# EAGLE design shield_ESP (EAGLE 6.5.0)
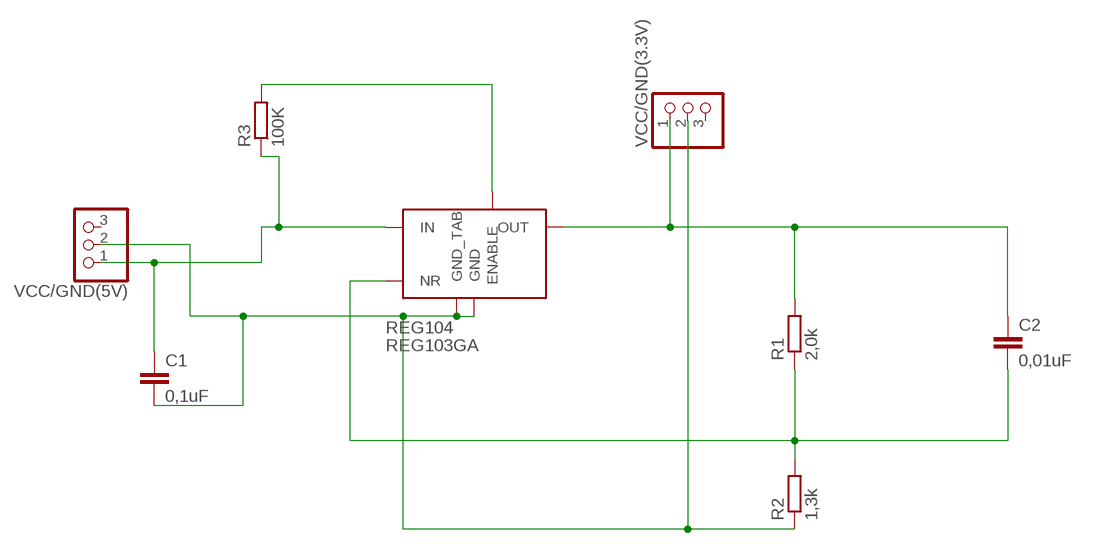
[diagram p0: schematic, sheet 1]

## Parts
C1  0,1uF  C-EU025-025X050  [C025-025X050]
C2  0,01uF  C-EU025-025X050  [C025-025X050]
R1  2,0k  R-EU_0207/7  [0207/7]
R2  1,3k  R-EU_0207/7  [0207/7]
R3  100K  R-EU_0207/7  [0207/7]
REG104  REG103GA  [SOT223-5]
VCC/GND(3.3V)  PINHD-1X3/90  [1X03/90]
VCC/GND(5V)  PINHD-1X3/90  [1X03/90]

## Nets
GOUT: C1.2 R2.1 REG104.3(GND) REG104.TAB(GND_TAB) VCC/GND(3.3V).2 VCC/GND(5V).2
N$1: C1.1 R3.1 REG104.1(IN) VCC/GND(5V).1
N$3: C2.2 R1.1 R2.2 REG104.4(NR)
N$4: R3.2 REG104.5(ENABLE)
VOUT: C2.1 R1.2 REG104.2(OUT) VCC/GND(3.3V).1
Unconnected: VCC/GND(3.3V).3 VCC/GND(5V).3

## Library data of the parts
C1 C2 = rcl:C-EU: CAPACITOR, European symbol
R1-R3 = rcl:R-EU_: RESISTOR, European symbol
REG104 = AlexW-Eagle-Libraries:REG103
VCC/GND(3.3V) VCC/GND(5V) = pinhead:PINHD-1X3: PIN HEADER

## Board
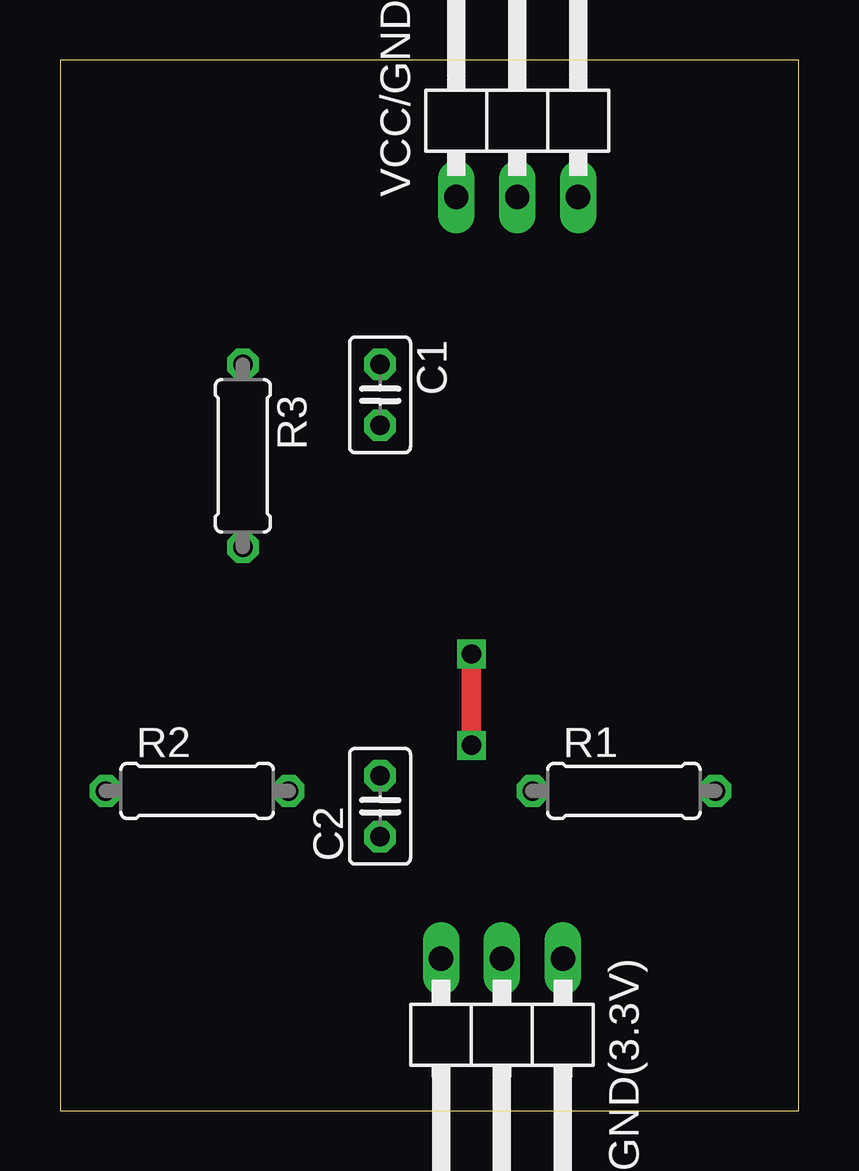
[diagram p1: board, top side]
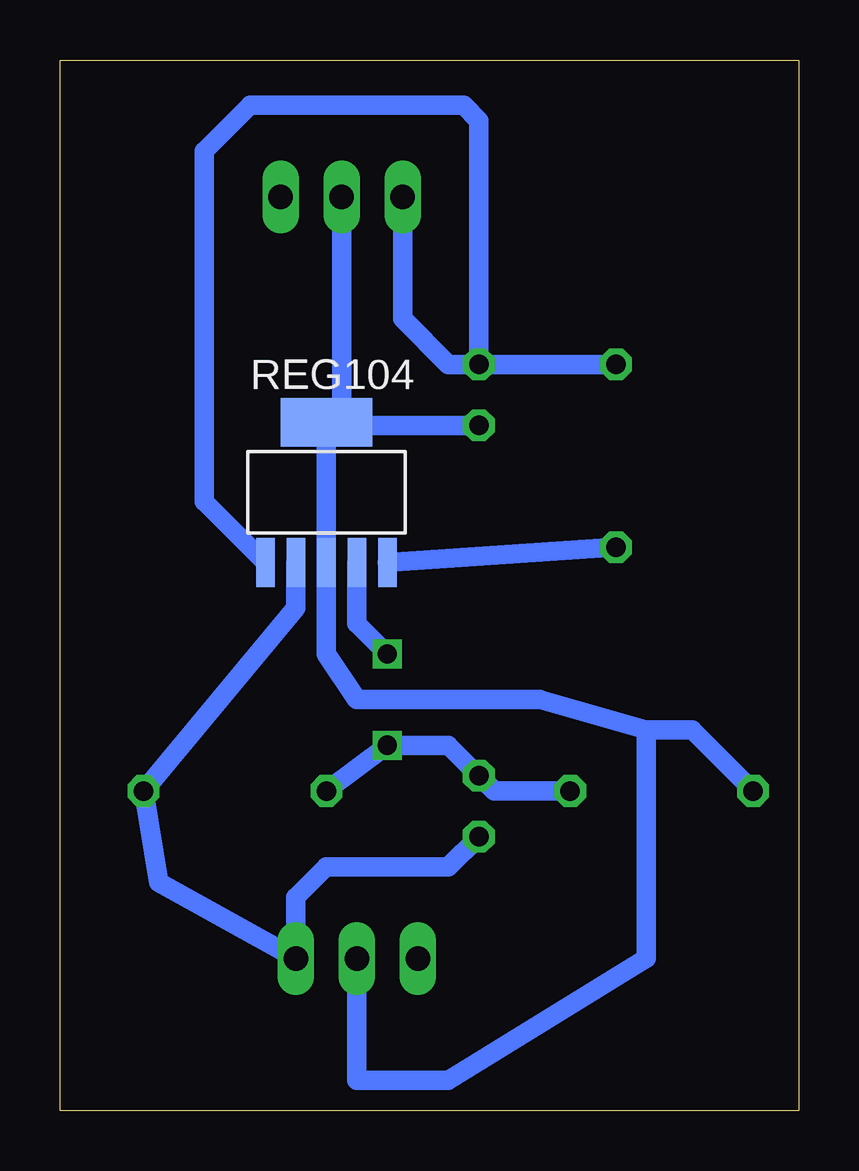
[diagram p2: board, bottom side, seen from below]

Size 30.78 x 43.8 mm. Coordinates in mm from the lower left corner, seen from the top.
Outline: 0,0 30.78,0 30.78,43.8 0,43.8 0,0
Copper layers (1*16): Top 0.035mm / dielectric 1.5mm / Bottom 0.035mm
Design rules "default *": minimum track width 30mil, minimum drill 24mil, track to track 30mil, track to pad 30mil, pad to pad 30mil, via to via 30mil, smd to smd 30mil, copper to edge 40mil, drill to drill 8mil, minimum pad ring 10mil, minimum via ring 8mil, stop-mask expansion 4mil, vias tented up to drill 0mil, thermal gap 10mil

### Footprints (pad centres in the part's own frame; a part is rotated, then mirrored left to right if it is on the bottom)
C025-025X050 = drill 0.813 octagon: 1 -1.27,0; 2 1.27,0
0207/7 = drill 0.813 octagon: 1 -3.81,0; 2 3.81,0
SOT223-5 = smd 0.762 x 2.032: 1 -2.54,-2.54; 2 -1.27,-2.54; 3 0,-2.54; 4 1.27,-2.54; 5 2.54,-2.54 | smd 3.81 x 2.007: TAB 0,3.302
1X03/90 = drill 1.016 long: 1 -2.54,-3.81; 2 0,-3.81; 3 2.54,-3.81

### Placement (x,y rotation side)
C1  13.34,29.84 270 top
C2  13.34,12.7 90 top
R1  23.49,13.34 0 top
R2  5.71,13.34 0 top
R3  7.62,27.3 270 top
REG104  19.68,25.4 0 bottom
VCC/GND(3.3V)  18.41,2.54 180 top
VCC/GND(5V)  19.05,41.91 0 top

### Tracks (layer width: path | path; a pad name or v marks a point on that pad's centre or on a via)
GOUT
  Bottom 0.813: VCC/GND(3.3V).2 18.41,1.27 14.61,1.27 6.35,6.35 6.35,15.88 | 6.35,15.88 10.79,17.14 18.41,17.14 19.68,19.05 REG104.3 REG104.TAB | 6.35,15.88 4.44,15.88 R2.1 | VCC/GND(5V).2 19.05,29.34 REG104.TAB | C1.2 19.56,28.57 REG104.TAB
N$1
  Bottom 0.813: R3.1 C1.1 | C1.1 14.61,31.11 16.51,33.02 VCC/GND(5V).1 | C1.1 13.34,41.27 13.97,41.91 22.86,41.91 24.77,40.01 24.77,25.4 REG104.1
N$3  (via drill 0.8)
  Top 0.813: v17.14,19.05 v17.14,15.24
  Bottom 0.813: REG104.4 18.41,20.32 v17.14,19.05 | R1.1 v17.14,15.24 14.61,15.24 C2.2 12.7,13.34 R2.2
N$4
  Bottom 0.813: REG104.5 R3.2
VOUT
  Bottom 0.813: C2.1 14.61,10.16 19.68,10.16 20.95,8.89 VCC/GND(3.3V).1 26.67,9.53 R1.2 20.95,20.95 REG104.2